# Altium schematic sheet OPID[352] 3.3V Step-down regulator.SchDoc: 3.3V Step-down regulator
size A4; Author: Andreas Tesaker; CompanyName: VORTEX NTNU; Revision: A; SheetNumber: 3
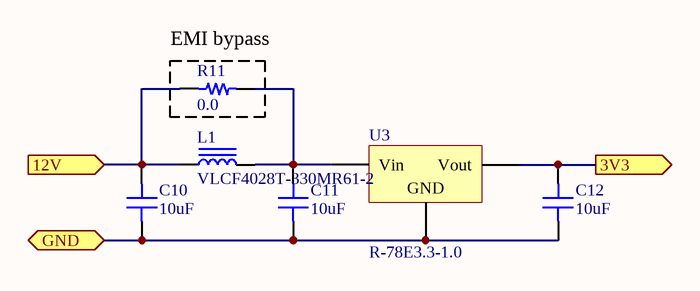
[diagram p0: OPID[352] 3.3V Step-down regulator.SchDoc]

## Parts
C10  10uF  [CAP 1210/3225 - 2.8MM]
C11  10uF  [CAP 1210/3225 - 2.8MM]
C12  10uF  [CAP 1210/3225 - 2.8MM]
L1  VLCF4028T-330MR61-2  [TDK VLCF4028-2]
R11  0.0  [RES 0805/2012]
U3  R-78E3.3-1.0  [R-78Exx-1.0]

## Ports
3V3 (out), 12V (in), GND

## Nets
3V3: C12.2 U3.3(Vout) ; port 3V3
12V: C10.2 L1.1 R11.1 ; port 12V
GND: C10.1 C11.1 C12.1 U3.2(GND) ; port GND
NetC11_2: C11.2 L1.2 R11.2 U3.1(Vin)

## Notes on the sheet
- (near R11) EMI bypass
- Title
- Size
- Author
- Rev
- A4
- Sheet no.
- of

## Library data of the parts
C10-C12 = C3225X7S1H106M250AB: CAP CER 10UF 50V X7S 1210; Manufacturer: TDK Corporation; TemperatureRange: -55C ~ 125C; Tolerance: 20%; Value: 10uF; Part Number: C3225X7S1H106M250AB; PartId: 19089; Supplier 1: Digi-Key; Supplier Part Number 1: 445-4537-2-ND; ComponentLink1Description: Datasheet; ComponentLink1URL: https://product.tdk.com/info/en/catalog/datasheets/mlcc_commercial_general_en.pdf; ComponentLink2Description: Digi-Key Listing; ComponentLink2URL: https://www.digikey.com/product-detail/en/tdk-corporation/C3225X7S1H106M250AB/445-4537-2-ND/2042208; TemperatureCoefficient: X7S; Voltage: 50V; Price: 0,3578; Device Package: 1210 (3225 Metric)
L1 = VLCF4028T-330MR61-2: FIXED IND 33UH 610MA 350 MOHM; Manufacturer: TDK Corporation; Type: Wirewound; Material - Core: Ferrite; Tolerance: 20%; Shielding: Shielded; DC Resistance (DCR): 350 mOhm Max; Value: 33uH; Part Number: VLCF4028T-330MR61-2; PartId: 16423; Supplier 1: Digi-Key; Supplier Part Number 1: 445-6549-2-ND; ComponentLink1Description: Datasheet; ComponentLink1URL: https://product.tdk.com/info/en/catalog/datasheets/inductor_commercial_power_vlcf4028-2_en.pdf; ComponentLink2Description: Digi-Key Listing; ComponentLink2URL: https://www.digikey.com/product-detail/en/tdk-corporation/VLCF4028T-330MR61-2/445-6549-2-ND/2465306; Price: 0,441; Device Package: Nonstandard; Series: VLCF; Inductance: 33uH; Current Rating: 610mA; Current - Saturation: 610mA; Operating Temperature: -40C ~ 105C
R11 = 5106: RES SMD 0.0 OHM JUMPER 1/2W 0805; Part Number: 5106; Manufacturer: Keystone Electronics; PowerRating: 0.5W, 1/2W; Value: 0.0; PartId: 16148; Supplier 1: Digi-Key; Supplier Part Number 1: 36-5106TR-ND; ComponentLink1Description: Datasheet; ComponentLink1URL: http://www.keyelco.com/product-pdf.cfm?p=14039; ComponentLink2Description: Digi-Key Listing; ComponentLink2URL: https://www.digikey.com/product-detail/en/keystone-electronics/5106/36-5106TR-ND/5118868; Tolerance: Jumper; Price: 0,2505; Device Package: 0805 (2012 Metric)
U3 = R-78E3.3-1.0: Vin,min: 7V; Vin,max: 28V; Vout,nom: 3.3V; Iout,max: 1A; Part Number: R-78E3.3-1.0; ComponentLink1Description: Manufacturer Link; ComponentLink1URL: https://www.recom-power.com/; ComponentLink2Description: Datasheet; ComponentLink2URL: https://www.recom-power.com/pdf/Innoline/R-78Exx-1.0.pdf; Supplier 1: Digi-Key; Supplier Part Number 1: 945-2409-5-ND